# Altium project Schematic.PrjPcb
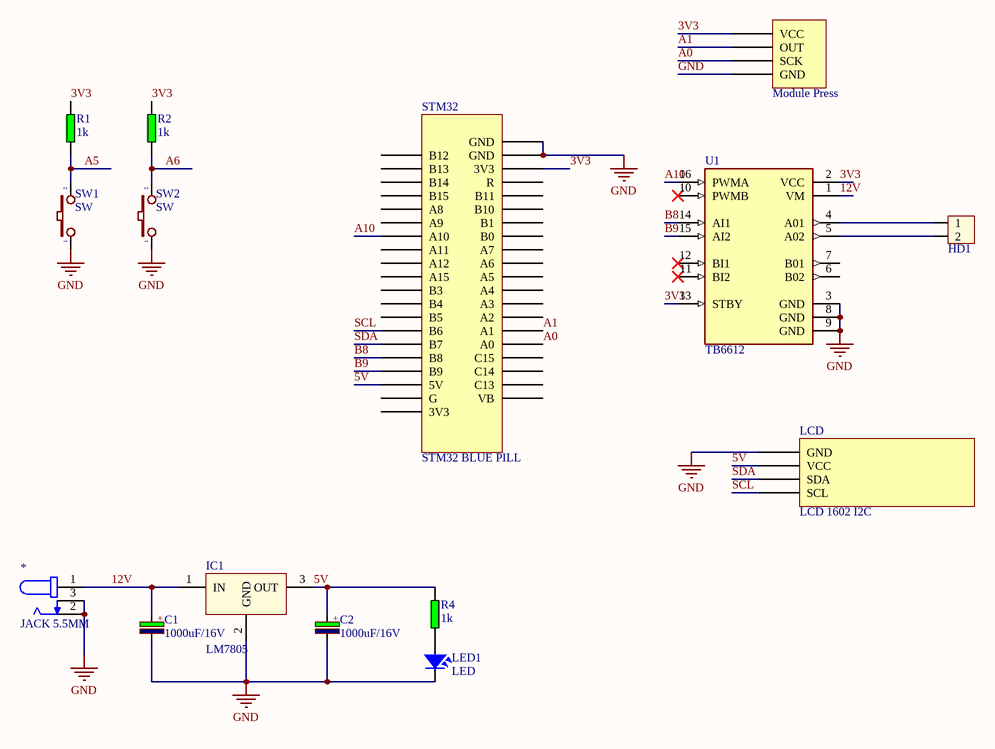
[diagram p0: Sheet1.SchDoc]
1 sheet, 15 parts. Net scope: global (net labels, ports and power ports of the same name join across sheets).
Board file: PCB1.PcbDoc

## Sheet Sheet1.SchDoc
size A; SheetNumber: 1; SheetTotal: 1

### Parts
*  JACK 5.5MM  [JACK 5.5MM]
C1  1000uF/16V  [CP1.5/3.4]
C2  1000uF/16V  [CP1.5/3.4]
HD?  HD1  [HED2]
IC1  LM7805  [QTO-220]
LCD  LCD 1602 I2C  [LCD1602]
LED1  LED  [LED-3]
R1  1k  [R1/4W]
R2  1k  [R1/4W]
R4  1k  [R1/4W]
STM32  STM32 BLUE PILL  [STM32F103C6]
SW1  SW  [SW2]
SW2  SW  [SW2]
U1  TB6612  [TB6612]
U2  Module Press  [MODULE PRESS]

### Nets
GND: *.2 *.3 C1.2 C2.2 IC1.2(GND) LCD.1(GND) LED1.2 STM32.1(GND) STM32.2(GND) SW1.1 SW2.1 U1.3(GND) U1.8(GND) U1.9(GND) U2.1(GND)
3V3: R1.2 R2.2 STM32.3(3V3) U1.2(VCC) U1.13(STBY) U2.4(VCC)
5V: C2.1 IC1.3(OUT) LCD.2(VCC) R4.2 STM32.23(5V)
12V: *.1 C1.1 IC1.1(IN) U1.1(VM)
A0: STM32.16(A0) U2.2(SCK)
A1: STM32.15(A1) U2.3(OUT)
A5: R1.1 SW1.2
A6: R2.1 SW2.2
A10: STM32.34(A10) U1.16(PWMA)
B8: STM32.25(B8) U1.14(AI1)
B9: STM32.24(B9) U1.15(AI2)
SCL: LCD.4(SCL) STM32.27(B6)
SDA: LCD.3(SDA) STM32.26(B7)
NetHD?_1: HD?.1 U1.4(A01)
NetHD?_2: HD?.2 U1.5(A02)
NetLED1_1: LED1.1 R4.1

Not connected (* = marked no-connect by the designer): STM32 4(R) 5(B11) 6(B10) 7(B1) 8(B0) 9(A7) 10(A6) 11(A5) 12(A4) 13(A3) 14(A2) 17(C15) 18(C14) 19(C13) 20(VB) 21(3V3) 22(G) 28(B5) 29(B4) 30(B3) 31(A15) 32(A12) 33(A11) 35(A9) 36(A8) 37(B15) 38(B14) 39(B13) 40(B12); U1 6(B02) 7(B01) 10(PWMB)* 11(BI2)* 12(BI1)*

### Notes on the sheet
- (in symbol CP4) +

### Library data of the parts
C1 C2 = CP4: Cap 1000uF/16V - 220uF/50V; Description 5: 4,7uF>10uF/250V_3,3uF>10uF/400V - 2,2uF>4,7uF/450V; Description 1: 2200uF-3300uF/6,3V - 1000uF-2200uF/10V; Description 2: 1000uF/16V - 470uF => 1000uF/25V - 100uF/100V; Description 3: 330uF>470uF/35V_220uF>470uF/50V_10uF>22uF/250V; Description 4: 220uF => 330uF/63V - 10uF =>33uF/160 - 200V; Value: 1000uF/16V
HD? = Hed2: Header 2 (Green); Value: Header 2
IC1 = LM78xx: On ap +, from + 5 to + 24VDC; Value: LM7805
LED1 = LED: LED Single colour Green and Red; Value: LED 3 ly Single Colour
R1 R2 R4 = RES: Resistor 1/4W; Value: R1/4W - 1K
STM32 = STM32 BLUE PILL: MODULE
SW1 SW2 = SW2: Switch button 2 pin; Value: SW chip 2 pin